# EasyEDA schematic THQRight Throttle Hat Board.json
TITLE: 5-Way Hat Board; REV: 1.4; Date: 2023-06-04; Sheet: 1/1; Company: Darren Eckert
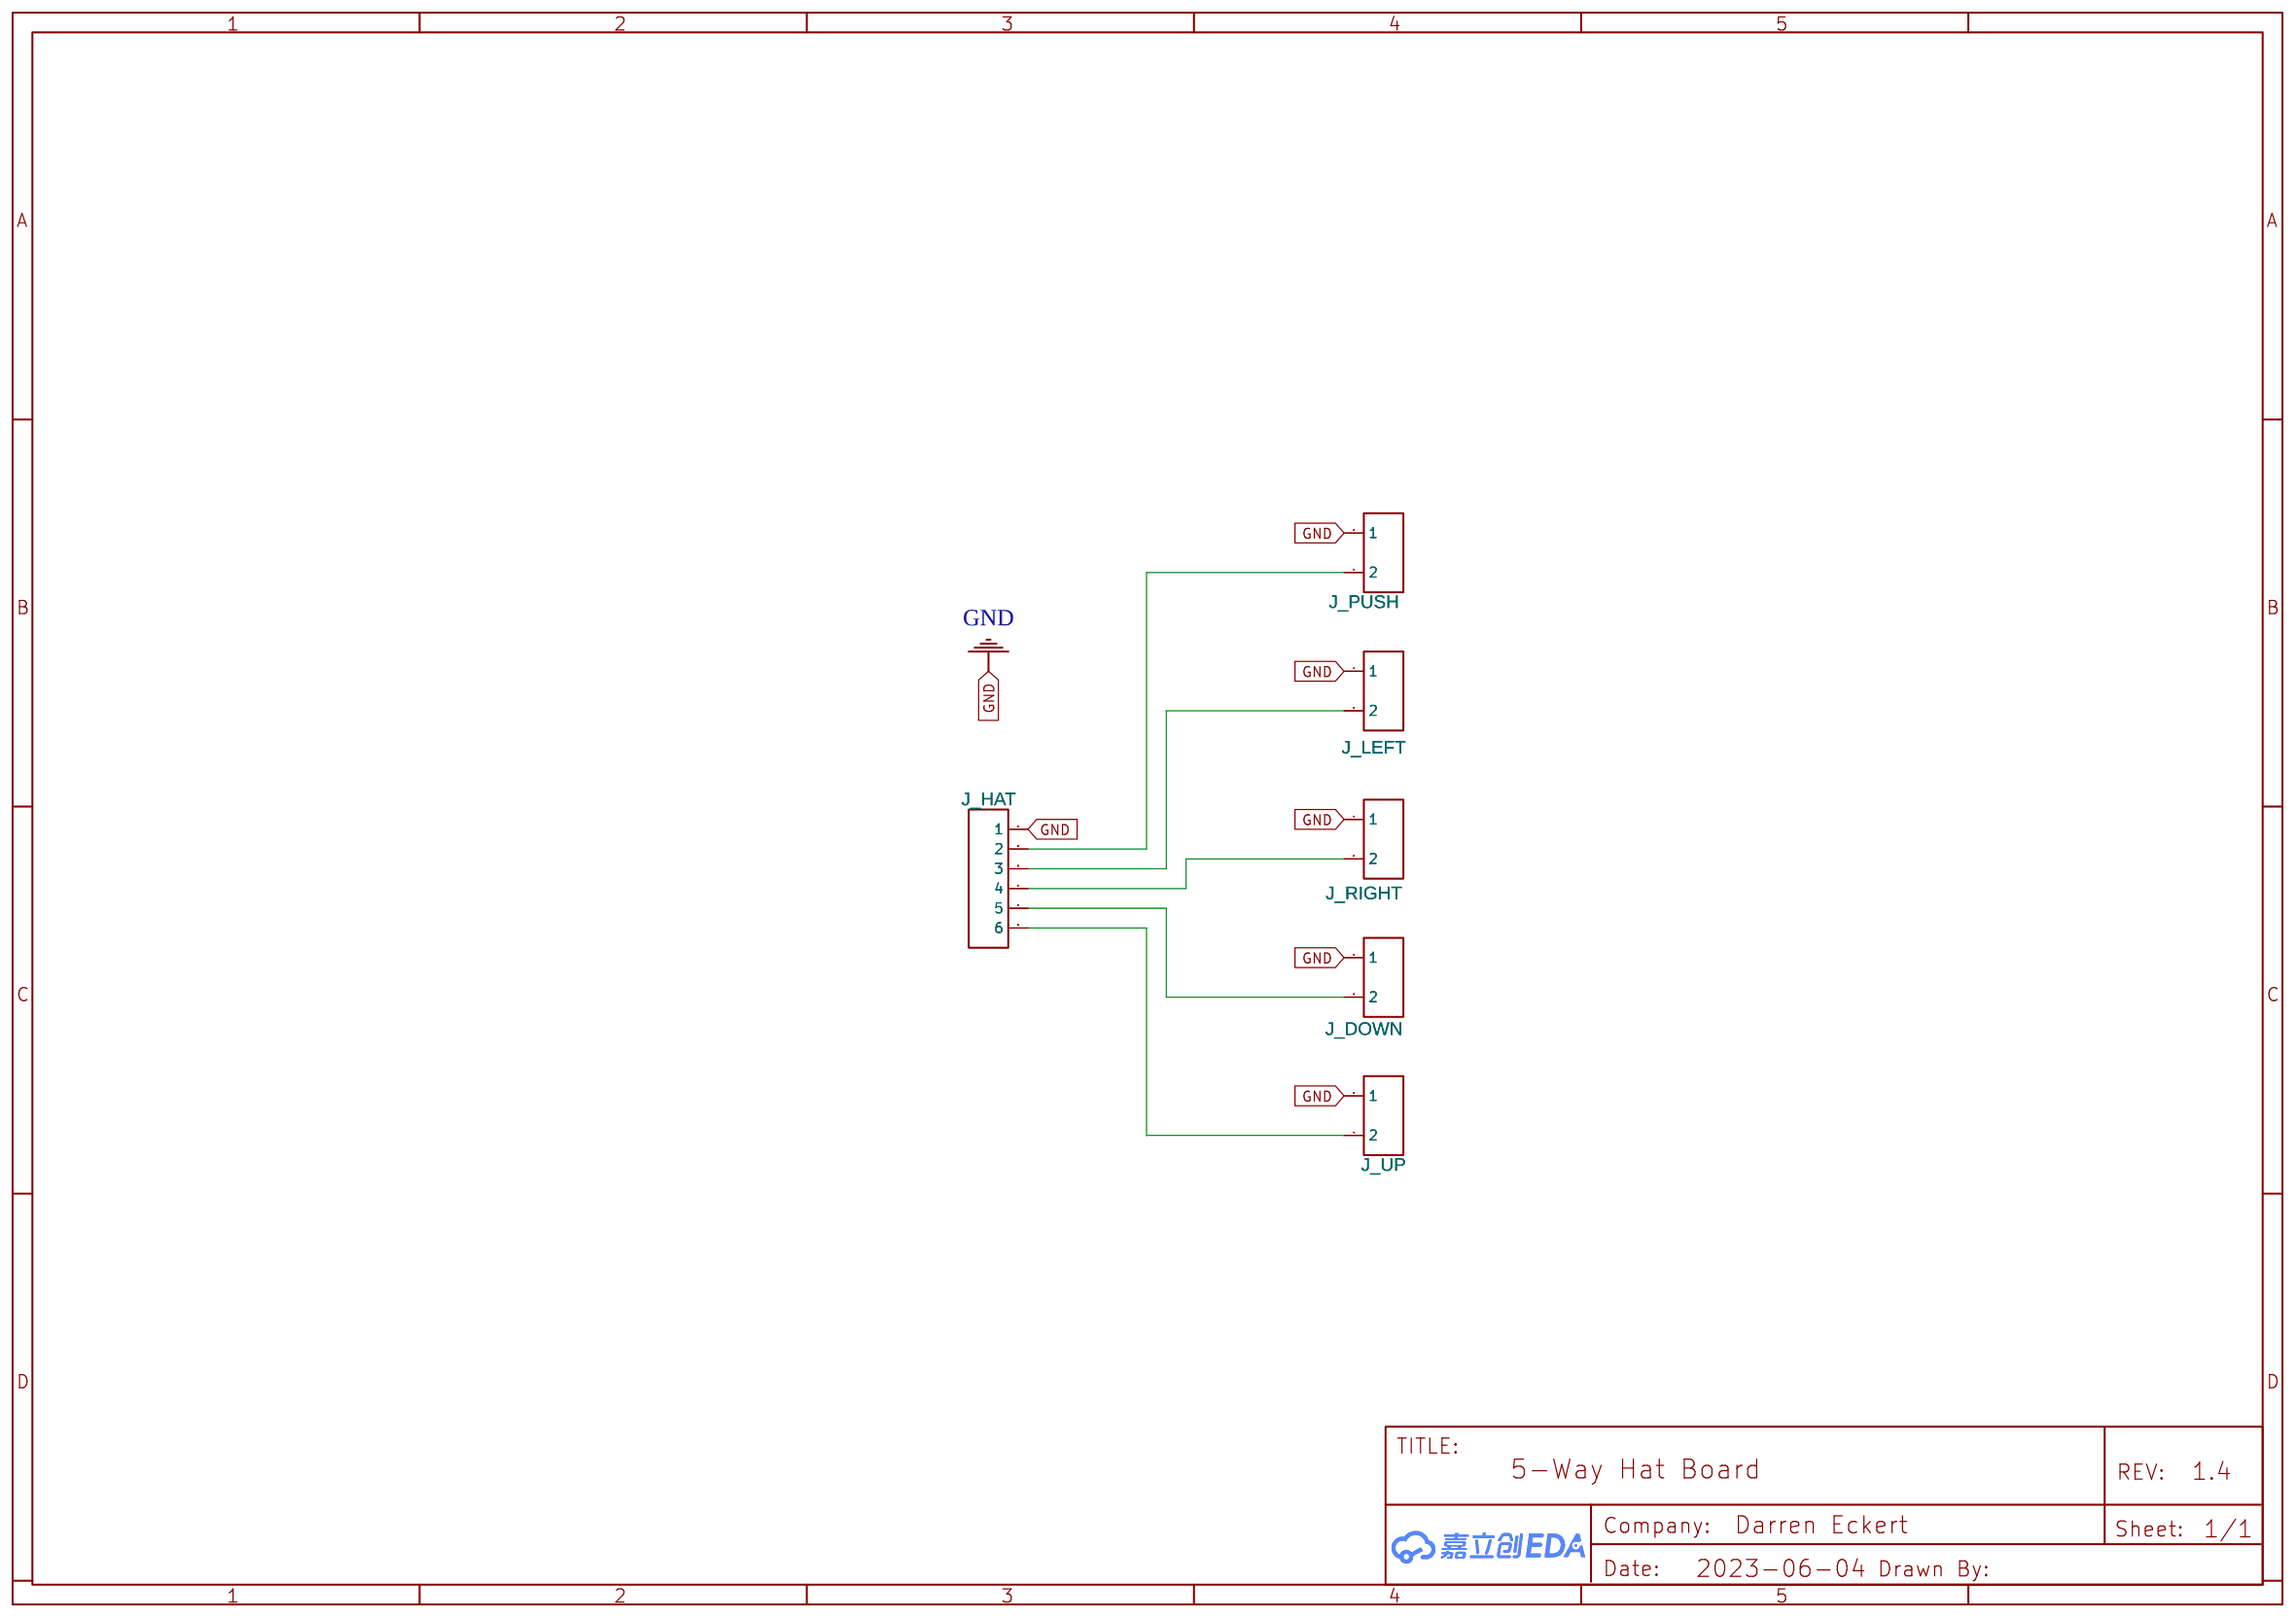
[diagram p0: schematic sheet]

## Parts
J_DOWN  Header-Male-2.54_1x2  [HDR-TH_2P-P2.54-V-M-1]
J_HAT  Header-Male-2.54_1x6  [HDR-TH_6P-P2.54-V-M-1]
J_LEFT  Header-Male-2.54_1x2  [HDR-TH_2P-P2.54-V-M-1]
J_PUSH  Header-Male-2.54_1x2  [HDR-TH_2P-P2.54-V-M-1]
J_RIGHT  Header-Male-2.54_1x2  [HDR-TH_2P-P2.54-V-M-1]
J_UP  Header-Male-2.54_1x2  [HDR-TH_2P-P2.54-V-M-1]

## Library data of the parts
J_DOWN J_LEFT J_PUSH J_RIGHT J_UP = Header-Male-2.54_1x2: Supplier: LCSC; Manufacturer: TE Connectivity(美国泰科); Manufacturer Part: 826629-2; Supplier Part: C86471; JLCPCB Part Class: Extended Part
J_HAT = Header-Male-2.54_1x6: Supplier: LCSC; Manufacturer: BOOMELE(博穆精密); Manufacturer Part: 2.54-1x6P直针; Supplier Part: C37208; JLCPCB Part Class: Extended Part

## Nets
GND: J_DOWN.1 J_HAT.1 J_LEFT.1 J_PUSH.1 J_RIGHT.1 J_UP.1
Net-(J_DOWN-2): J_DOWN.2 J_HAT.5
Net-(J_HAT-2): J_HAT.2 J_PUSH.2
Net-(J_HAT-3): J_HAT.3 J_LEFT.2
Net-(J_HAT-4): J_HAT.4 J_RIGHT.2
Net-(J_HAT-6): J_HAT.6 J_UP.2
